# Altium schematic sheet sch_stm32.SCHDOC: Dynamic Torque Monitor
size A2; Revision: v2-mini; SheetNumber: SCHV2-mini
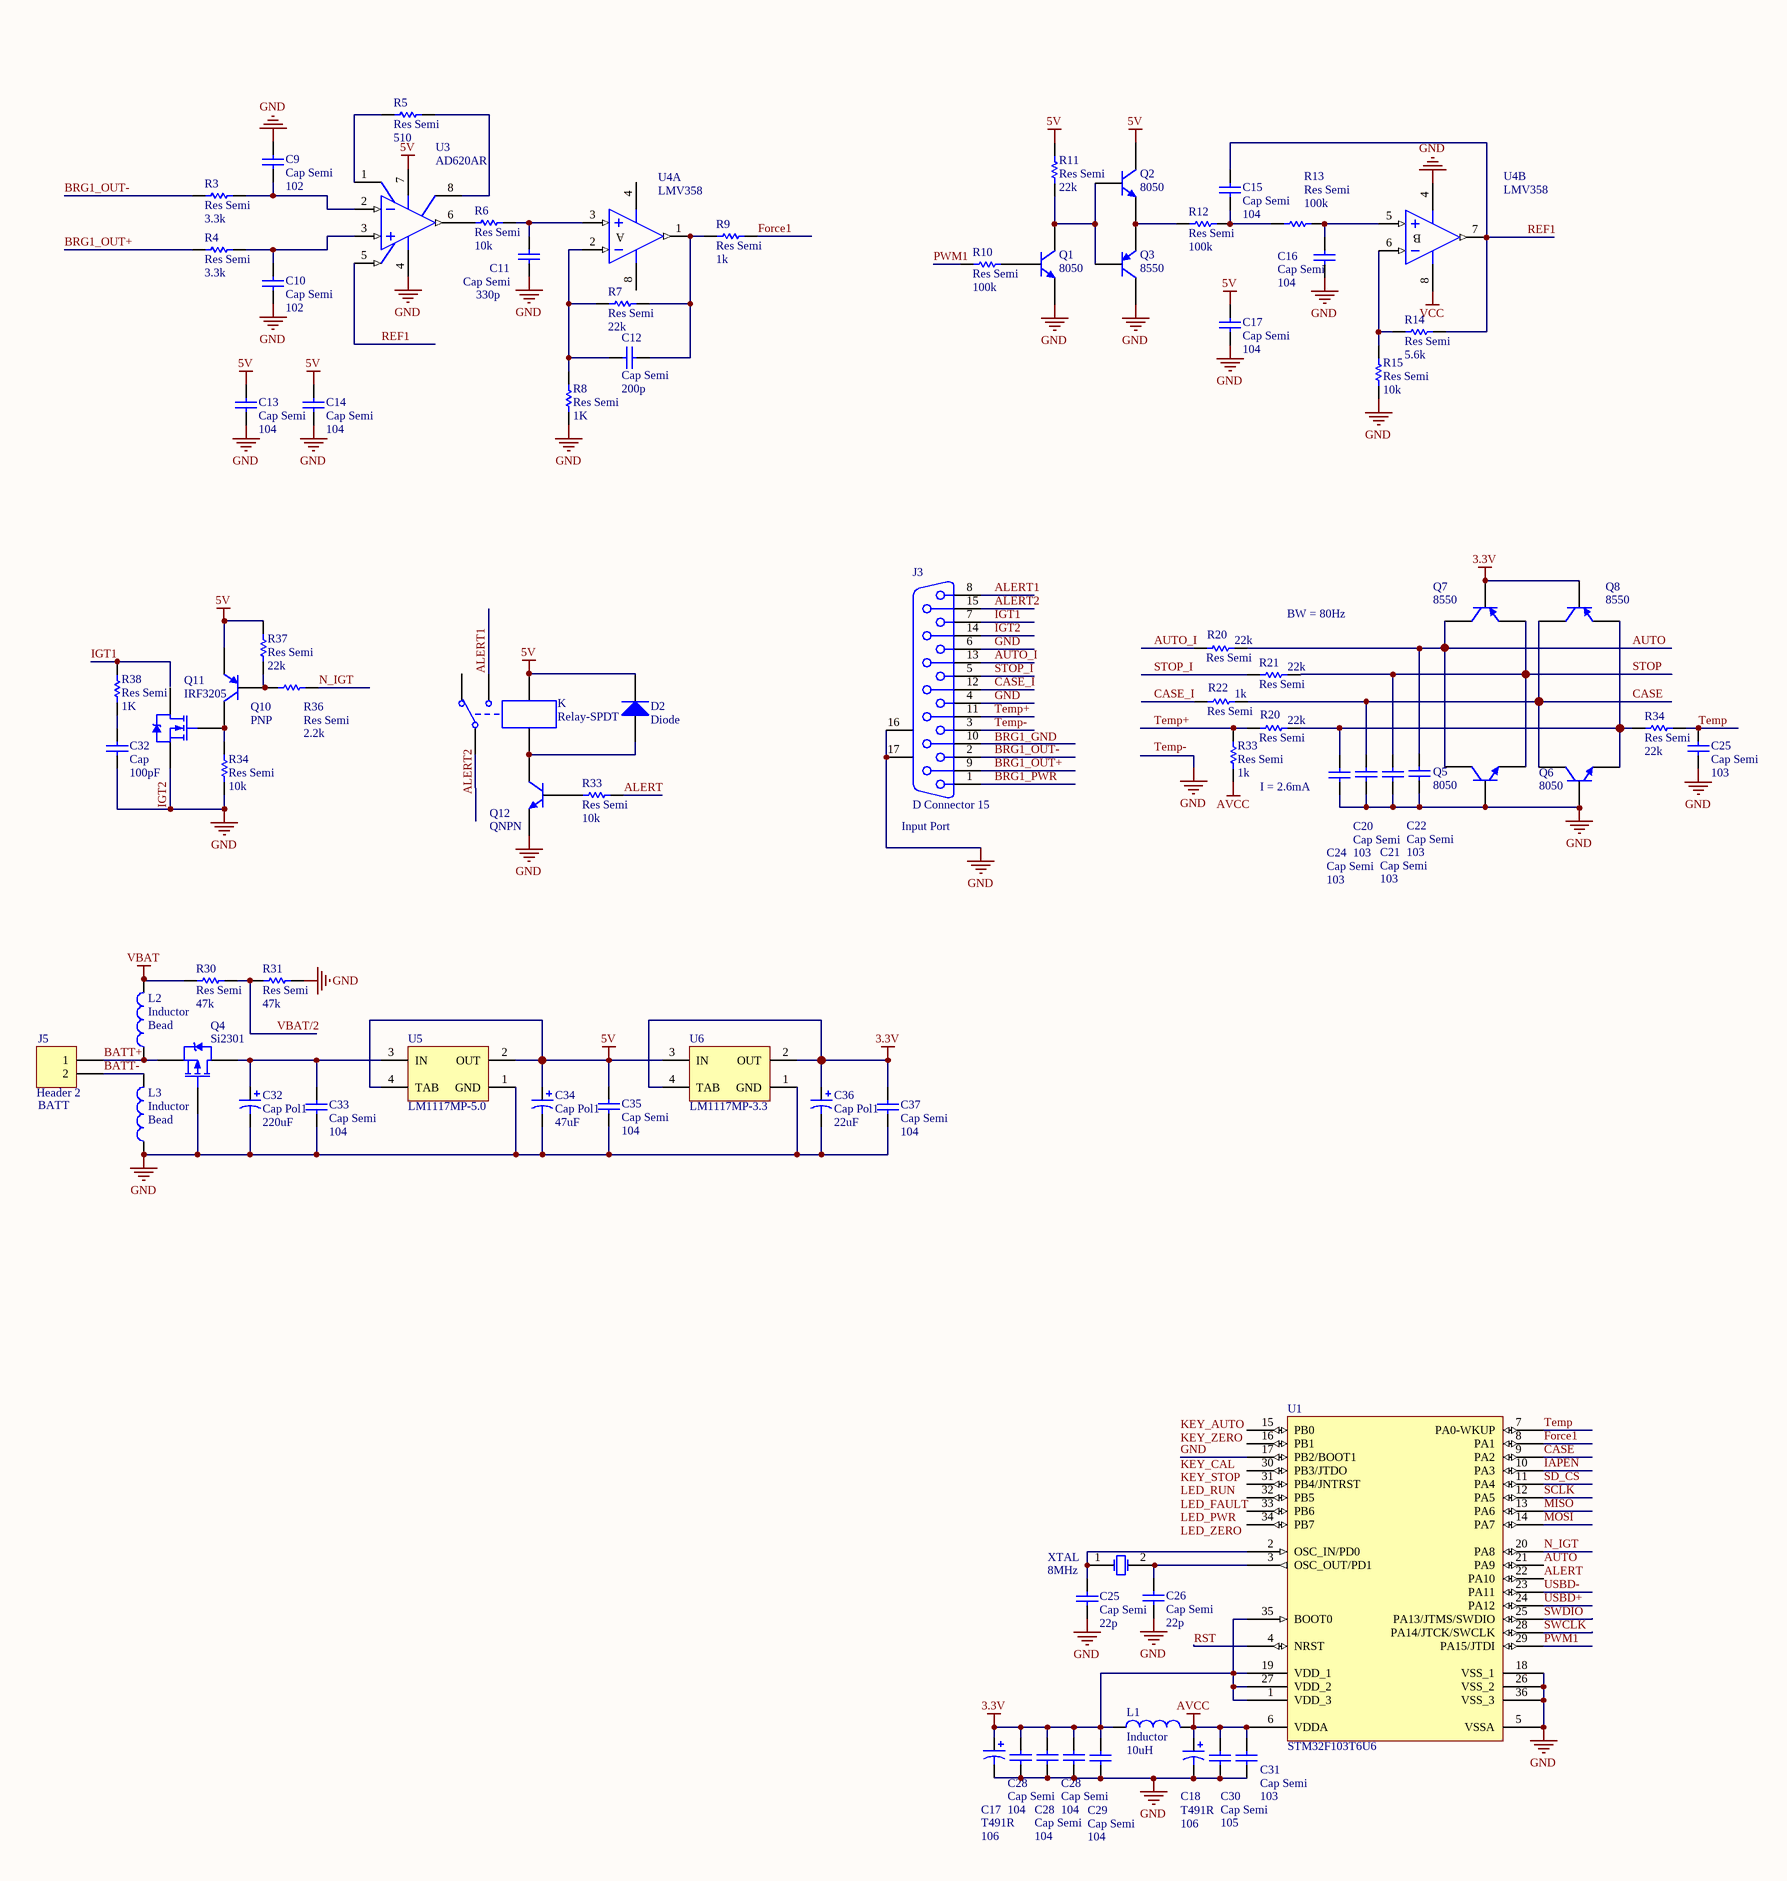
[diagram p0: sch_stm32.SCHDOC, left]
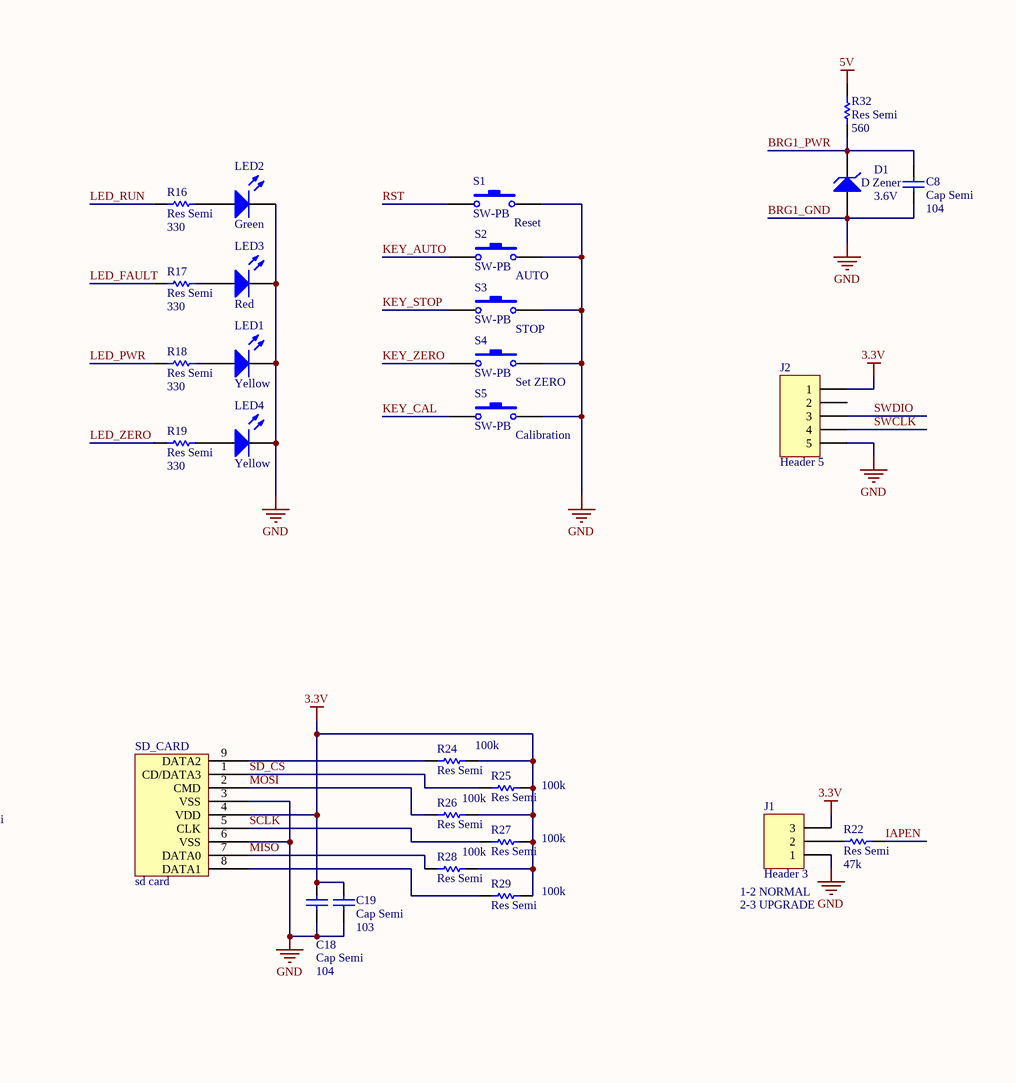
[diagram p1: sch_stm32.SCHDOC, right]

## Parts
(Parts that share a designator on the sheet are numbered #1, #2 ... from top to bottom, then left to right.)
C8  Cap Semi  value 104  [CAPC2012N]
C9  Cap Semi  value 102  [CAPC2012N]
C10  Cap Semi  value 102  [CAPC2012N]
C11  Cap Semi  value 330p  [C0805]
C12  Cap Semi  value 200p  [CAPC2012N]
C13  Cap Semi  value 104  [CAPC2012N]
C14  Cap Semi  value 104  [CAPC2012N]
C15  Cap Semi  value 104  [CAPC2012N]
C16  Cap Semi  value 104  [CAPC2012N]
C17#1  Cap Semi  value 104  [CAPC2012N]
C17#2  T491R  value 106  [R]
C18#1  Cap Semi  value 104  [CAPC2012N]
C18#2  T491R  value 106  [R]
C19  Cap Semi  value 103  [CAPC2012N]
C20  Cap Semi  value 103  [CAPC2012N]
C21  Cap Semi  value 103  [CAPC2012N]
C22  Cap Semi  value 103  [CAPC2012N]
C24  Cap Semi  value 103  [C0805]
C25#1  Cap Semi  value 103  [C0805]
C25#2  Cap Semi  value 22p  [CAPC2012N]
C26  Cap Semi  value 22p  [CAPC2012N]
C28#1  Cap Semi  value 104  [CAPC2012N]
C28#2  Cap Semi  value 104  [CAPC2012N]
C28#3  Cap Semi  value 104  [CAPC2012N]
C29  Cap Semi  value 104  [CAPC2012N]
C30  Cap Semi  value 105  [CAPC2012N]
C31  Cap Semi  value 103  [CAPC2012N]
C32#1  Cap  value 100pF  [RAD-0.3]
C32#2  Cap Pol1  value 220uF  [RB7.6-15]
C33  Cap Semi  value 104  [CAPC2012N]
C34  Cap Pol1  value 47uF  [RB7.6-15]
C35  Cap Semi  value 104  [C0805]
C36  Cap Pol1  value 22uF  [RB7.6-15]
C37  Cap Semi  value 104  [C0805]
D1  D Zener  Voltage: 3.6V  [DIODE-0.7]
D2  Diode  [SMC]
J1  Header 3  [HDR1X3]
J2  Header 5  [HDR1X5]
J3  D Connector 15  [DSUB1.385-2H15]
J5  Header 2  [HDR1X2]
K  Relay-SPDT  [MODULE5B]
L1  Inductor  value 10uH  [INDC2012N]
L2  Inductor  value Bead  [AXIAL-0.3]
L3  Inductor  value Bead  [AXIAL-0.3]
LED1  Yellow  [2.0X1.25X0.8A]
LED2  Green  [2.0X1.25X0.8A]
LED3  Red  [2.0X1.25X0.8A]
LED4  Yellow  [2.0X1.25X0.8A]
Q1  8050  [SOT-23B_N]
Q2  8050  [SOT-23B_N]
Q3  8550  [SOT-23B_N]
Q4  Si2301  [SOT-23B_L]
Q5  8050  [TO-92A]
Q6  8050  [TO-92A]
Q7  8550  [TO-92A]
Q8  8550  [TO-92A]
Q10  PNP  [SOT-23B_N]
Q11  IRF3205  [TO-220AB]
Q12  QNPN  [SOT-23B_N]
R3  Res Semi  value 3.3k  [6-0805_N]
R4  Res Semi  value 3.3k  [6-0805_N]
R5  Res Semi  value 510  [6-0805_N]
R6  Res Semi  value 10k  [6-0805_N]
R7  Res Semi  value 22k  [6-0805_N]
R8  Res Semi  value 1K  [6-0805_N]
R9  Res Semi  value 1k  [6-0805_N]
R10  Res Semi  value 100k  [6-0805_N]
R11  Res Semi  value 22k  [6-0805_N]
R12  Res Semi  value 100k  [6-0805_N]
R13  Res Semi  value 100k  [6-0805_N]
R14  Res Semi  value 5.6k  [6-0805_N]
R15  Res Semi  value 10k  [6-0805_N]
R16  Res Semi  value 330  [6-0805_N]
R17  Res Semi  value 330  [6-0805_N]
R18  Res Semi  value 330  [6-0805_N]
R19  Res Semi  value 330  [6-0805_N]
R20#1  Res Semi  value 22k  [6-0805_N]
R20#2  Res Semi  value 22k  [6-0805_N]
R21  Res Semi  value 22k  [6-0805_N]
R22#1  Res Semi  value 1k  [6-0805_N]
R22#2  Res Semi  value 47k  [6-0805_N]
R24  Res Semi  value 100k  [6-0805_N]
R25  Res Semi  value 100k  [6-0805_N]
R26  Res Semi  value 100k  [6-0805_N]
R27  Res Semi  value 100k  [6-0805_N]
R28  Res Semi  value 100k  [6-0805_N]
R29  Res Semi  value 100k  [6-0805_N]
R30  Res Semi  value 47k  [6-0805_N]
R31  Res Semi  value 47k  [6-0805_N]
R32  Res Semi  value 560  [6-0805_N]
R33#1  Res Semi  value 1k  [0805[2012]]
R33#2  Res Semi  value 10k  [0805[2012]]
R34#1  Res Semi  value 22k  [0805[2012]]
R34#2  Res Semi  value 10k  [0805[2012]]
R36  Res Semi  value 2.2k  [0805[2012]]
R37  Res Semi  value 22k  [0805[2012]]
R38  Res Semi  value 1K  [AXIAL-0.5]
S1  SW-PB  [KEY_4]
S2  SW-PB  [KEY_4]
S3  SW-PB  [KEY_4]
S4  SW-PB  [KEY_4]
S5  SW-PB  [KEY_4]
SD_CARD  sd card  [SD card]
U1  STM32F103T6U6  [VFQN36_M]
U3  AD620AR  [R-8D_N]
U4  LMV358  [SO8_N]  (parts A,B of 2)
U5  LM1117MP-5.0  [MP04A_N]
U6  LM1117MP-3.3  [MP04A_N]
XTAL  8MHz  [CRYSTAL]

## Nets
3.3V: C17#2.1 C18#1.2 C19.2 C28#1.2 C28#2.2 C28#3.2 C29.2 C36.1 C37.2 J1.3 J2.1 L1.1 Q7.2(B) Q8.2(B) R24.2 R25.2 R26.2 R27.2 R28.2 R29.2 SD_CARD.4(VDD) U1.1(VDD_3) U1.19(VDD_1) U1.27(VDD_2) U1.35(BOOT0) U6.2(OUT) U6.4(TAB)
5V: C13.1 C14.1 C17#1.1 C34.1 C35.2 D2.2(K) K.5 Q2.1(C) Q10.3(E) R11.2 R32.2 R37.2 U3.7(V+) U5.2(OUT) U5.4(TAB) U6.3(IN)
AVCC: C18#2.1 C30.2 C31.2 L1.2 R33#1.1 U1.6(VDDA)
BRG1_GND: C8.2 C9.2 C10.1 C11.1 C13.2 C14.2 C16.2 C17#1.2 C17#2.2 C18#1.1 C18#2.2 C19.1 C20.1 C21.1 C22.1 C24.1 C25#1.1 C25#2.1 C26.1 C28#1.1 C28#2.1 C28#3.1 C29.1 C30.1 C31.1 C32#1.1 C32#2.2 C33.1 C34.2 C35.1 C36.2 C37.1 D1.1(A) J1.1 J2.5 J3.4 J3.6 J3.14 J3.16(MH1) J3.17(MH2) L3.1 LED1.2(K) LED2.2(K) LED3.2(K) LED4.2(K) Q1.3(E) Q3.1(C) Q4.1(G) Q5.2(B) Q6.2(B) Q11.3(S) Q12.3(E) R8.1 R15.1 R31.1 R34#2.1 S1.2 S2.2 S3.2 S4.2 S5.2 SD_CARD.3(VSS) SD_CARD.6(VSS) U1.5(VSSA) U1.17(PB2/BOOT1) U1.18(VSS_1) U1.26(VSS_2) U1.36(VSS_3) U3.4(V-) U4.4(V-) U5.1(GND) U6.1(GND)  [also labelled GND, IGT2]
VBAT: L2.2 R30.2
VCC: U4.8(V+)
ALERT: R33#2.2 U1.22(PA10)
ALERT1: J3.8 K.3
ALERT2: J3.15 K.1
AUTO: C22.2 R20#1.2 U1.21(PA9)
AUTO_I: J3.13 R20#1.1
BATT+: J5.1 L2.1 Q4.3(S)
BATT-: J5.2 L3.2
BRG1_OUT+: J3.9 R4.1
BRG1_OUT-: J3.2 R3.1
BRG1_PWR: C8.1 D1.2(K) J3.1 R32.1
CASE: C20.2 Q6.3(C) Q8.3(C) R22#1.2 U1.9(PA2)
CASE_I: J3.12 R22#1.1
Force1: R9.2 U1.8(PA1)
IAPEN: R22#2.1 U1.10(PA3)
IGT1: J3.7 R38.2
KEY_AUTO: S2.1
KEY_CAL: S5.1
KEY_STOP: S3.1
KEY_ZERO: S4.1
LED_FAULT: R17.1
LED_PWR: R18.1
LED_RUN: R16.1
LED_ZERO: R19.1
MISO: R28.1 SD_CARD.7(DATA0) U1.13(PA6)
MOSI: R26.1 SD_CARD.2(CMD) U1.14(PA7)
N_IGT: R36.2 U1.20(PA8)
PWM1: R10.2 U1.29(PA15/JTDI)
REF1: C15.1 R14.2 U3.5(REF) U4.7(OUT)
RST: S1.1 U1.4(NRST)
SCLK: R27.1 SD_CARD.5(CLK) U1.12(PA5)
SD_CS: R25.1 SD_CARD.1(CD/DATA3) U1.11(PA4)
STOP: C21.2 Q5.1(E) Q7.1(E) R21.2
STOP_I: J3.5 R21.1
SWCLK: J2.4 U1.28(PA14/JTCK/SWCLK)
SWDIO: J2.3 U1.25(PA13/JTMS/SWDIO)
Temp: C25#1.2 R34#1.2 U1.7(PA0-WKUP)
Temp+: J3.11 R20#2.1 R33#1.2
Temp-: J3.3
USBD+: U1.24(PA12)
USBD-: U1.23(PA11)
VBAT/2: R30.1 R31.2
NetC9_1: C9.1 R3.2 U3.2(-IN)
NetC10_2: C10.2 R4.2 U3.3(+IN)
NetC11_2: C11.2 R6.1 U4.3(IN+)
NetC12_1: C12.1 R7.2 R9.1 U4.1(OUT)
NetC12_2: C12.2 R7.1 R8.2 U4.2(IN-)
NetC15_2: C15.2 R12.2 R13.1
NetC16_1: C16.1 R13.2 U4.5(IN+)
NetC24_2: C24.2 Q6.1(E) Q8.1(E) R20#2.2 R34#1.1
NetC25#2_2: C25#2.2 U1.2(OSC_IN/PD0) XTAL.1(OSC1)
NetC26_2: C26.2 U1.3(OSC_OUT/PD1) XTAL.2(OSC2)
NetC32#1_2: C32#1.2 R38.1
NetC32#2_1: C32#2.1 C33.2 Q4.2(D) U5.3(IN)
NetD2_1: D2.1(A) K.4 Q12.1(C)
NetJ1_2: J1.2 R22#2.2
NetLED1_1: LED1.1(A) R18.2
NetLED2_1: LED2.1(A) R16.2
NetLED3_1: LED3.1(A) R17.2
NetLED4_1: LED4.1(A) R19.2
NetQ1_1: Q1.1(C) Q2.2(B) Q3.2(B) R11.1
NetQ1_2: Q1.2(B) R10.1
NetQ2_3: Q2.3(E) Q3.3(E) R12.1
NetQ5_3: Q5.3(C) Q7.3(C)
NetQ10_1: Q10.1(C) Q11.1(G) R34#2.2
NetQ10_2: Q10.2(B) R36.1 R37.1
NetQ12_2: Q12.2(B) R33#2.1
NetR5_1: R5.1 U3.1(RG)
NetR5_2: R5.2 U3.8(RG)
NetR6_2: R6.2 U3.6(OUT)
NetR14_1: R14.1 R15.2 U4.6(IN-)
NetR24_1: R24.1 SD_CARD.9(DATA2)
NetR29_1: R29.1 SD_CARD.8(DATA1)

Not connected (* = marked no-connect by the designer): J2 2; J3 10; K 2; Q11 2(D); U1 15(PB0) 16(PB1) 30(PB3/JTDO) 31(PB4/JNTRST) 32(PB5) 33(PB6) 34(PB7)

## Notes on the sheet
- (near S1) Reset
- (near S2) AUTO
- (near S3) STOP
- (near S4) Set ZERO
- (near S5) Calibration
- BW = 80Hz
- (near J3) Input Port
- I = 2.6mA
- (near J1) 1-2 NORMAL
- 2-3 UPGRADE
- (near J5) BATT
- Labels drawn without touching a wire or pin: BRG1_GND, KEY_AUTO, KEY_CAL, KEY_STOP, KEY_ZERO, LED_FAULT, LED_PWR, LED_RUN, LED_ZERO, Temp-
- (in symbol TL062CD, part A) A
- (in symbol TL062CD, part B) B

## Library data of the parts
C8-C16 C17#1 C18#1 C19-C22 C24 C25#1 C25#2 C26 C28#1-C28#3 C29-C31 C33 C35 C37 = Cap Semi: Capacitor (Semiconductor SIM Model); Published: 8-Jun-2000; PackageReference: C1206; Publisher: Altium Limited
  C8-C10 C12-C16 C17#1 C18#1 C19-C22 C25#2 C26 C28#1-C28#3 C29-C31: LatestRevisionDate: 17-Jul-2002; LatestRevisionNote: Re-released for DXP Platform.
  C11 C24 C25#1 C33 C35 C37: LatestRevisionDate: 29-May-2009; LatestRevisionNote: IPC-7351 Footprint Added.; PackageDescription: Chip Capacitor
C17#2 C18#2 = T491R: Solid Tantalum Chip Capacitor, Low Profile T491 Series - Industrial Grade; Published: 17-Jul-2002; LatestRevisionDate: 19-Mar-2004; LatestRevisionNote: Silkscreen dimensions re-sized.; DatasheetDocument: Mar-2001; PackageDocument: Mar-2001; PackageReference: R; Publisher: Altium Limited; Code_JEITA: 2012-12; ComponentLink1Description: Manufacturer Link; ComponentLink1URL: http://www.kemet.com/; ComponentLink2Description: Datasheet; ComponentLink2URL: http://www.kemet.com/kemet/web/homepage/kechome.nsf/vapubfilesname/F3102TA.pdf/$file/F3102TA.pdf
C32#1 = Cap: Capacitor; Published: 8-Jun-2000; LatestRevisionDate: 17-Jul-2002; LatestRevisionNote: Re-released for DXP Platform.; PackageReference: RAD-0.3; Publisher: Altium Limited; PackageDescription: Radial Cap, Thru-Hole; 2 Leads; 0.3 in Pin Spacing
C32#2 C34 C36 = Cap Pol1: Polarized Capacitor (Radial); Published: 8-Jun-2000; LatestRevisionDate: 17-Jul-2002; LatestRevisionNote: Re-released for DXP Platform.; PackageReference: RB7.6-15; Publisher: Altium Limited; PackageDescription: Polarized Capacitor (Radial); 2 Leads
D1 = D Zener: Zener Diode; Published: 8-Jun-2000; LatestRevisionDate: 17-Jul-2002; LatestRevisionNote: Re-released for DXP Platform.; PackageReference: DIODE-0.7; Publisher: Altium Limited; PackageDescription: Diode, Thru-Hole; 2 Leads; 0.7 in Pin Spacing
D2 = Diode: Default Diode; Published: 8-Jun-2000; LatestRevisionDate: 17-Jul-2002; LatestRevisionNote: Re-released for DXP Platform.; PackageVersion: Sep-1996; PackageReference: SMC; Publisher: Altium Limited; PackageDescription: DO-214-AB/SMC; 2 C-Bend Leads; Body 7.9 x 5.9 mm, inc. leads (LxW); Code_JEDEC: DO-214-AB
J1 = Header 3: Header, 3-Pin; LatestRevisionDate: 17-Jul-2002; LatestRevisionNote: Re-released for DXP Platform.; Publisher: Altium Limited
J2 = Header 5: Header, 5-Pin; LatestRevisionDate: 17-Jul-2002; LatestRevisionNote: Re-released for DXP Platform.; Publisher: Altium Limited
J3 = D Connector 15: Receptacle Assembly, 15 Position, Right Angle; PackageDocument: O; Positions: 15; Published: 15-Jun-2001; LatestRevisionDate: 17-Jul-2002; LatestRevisionNote: Re-released for DXP Platform.; DatasheetDocument: 1-Sep-99; PackageReference: 788757; Publisher: Altium Limited; Orientation: Right Angle; Gender: Receptacle
J5 = Header 2: Header, 2-Pin; LatestRevisionDate: 17-Jul-2002; LatestRevisionNote: Re-released for DXP Platform.; Publisher: Altium Limited
K = Relay-SPDT: Single-Pole Dual-Throw Relay; Published: 24-Mar-1999; LatestRevisionDate: 17-Jul-2002; LatestRevisionNote: Re-released for DXP Platform.; PackageReference: MODULE5B; Publisher: Altium Limited
L1-L3 = Inductor: Code_IEC: 1005; Published: 8-Jun-2000; LatestRevisionDate: 17-Jul-2002; LatestRevisionNote: Re-released for DXP Platform.; PackageReference: 0402-A; Publisher: Altium Limited; Code_JEITA: 0402
LED1-LED4 = LED1: Typical RED GaAs LED; Published: 8-Jun-2000; LatestRevisionDate: 08-Jul-2005; LatestRevisionNote: Mech Layer 1 removed.; PackageReference: LED-1; Publisher: Altium Limited
Q1 Q2 Q12 = QNPN: NPN Bipolar Transistor; Published: 8-Jun-2000; LatestRevisionDate: 29-May-2009; LatestRevisionNote: IPC-7351 Footprint Added.; PackageVersion: Aug-1999; PackageReference: SOT-23B; Publisher: Altium Limited; PackageDescription: 3-Pin SOT-23 Package 0.95 mm Pitch, 2.4 mm Lead Span
Q3 Q10 = PNP: PNP Bipolar Transistor; Published: 8-Jun-2000; LatestRevisionDate: 29-May-2009; LatestRevisionNote: IPC-7351 Footprint Added.; PackageVersion: Aug-1999; PackageReference: SOT-23B; Publisher: Altium Limited; PackageDescription: 3-Pin SOT-23 Package 0.95 mm Pitch, 2.4 mm Lead Span
Q4 = PMOS-2: P-Channel Power MOSFET; pin to pad: 2>3 3>2; Note: Pin 4 not drawn and electrically connected to Pin 2.; Published: 8-Jun-2000; LatestRevisionDate: 17-Jul-2002; LatestRevisionNote: Re-released for DXP Platform.; DatasheetVersion: PD-9.390D; PackageVersion: Feb-1997; PackageReference: TO-220AB; Publisher: Altium Limited; PackageDescription: TO, Thru-Hole, Vertical, Heatsink Mounted; 3 In-Line Leads; Pitch 2.54 mm; ComponentLink1Description: Manufacturer Link; ComponentLink1URL: http://www.irf.com/
Q5 Q6 = 2N3904: NPN General Purpose Amplifier; Published: 8-Jun-2000; LatestRevisionDate: 15-Jan-2003; LatestRevisionNote: PCB Footprint 'BCY-W3/D4.7' replaced; DatasheetVersion: 1997; PackageVersion: Sep-1998; PackageReference: TO-92A; Publisher: Altium Limited; PackageDescription: TO, Flat Index; 3 In-Line, Axial Leads; Body Dia. 4.5mm; Leads 0.51 x 0.48 mm (max); ComponentLink1Description: Manufacturer Link; ComponentLink1URL: http://www.fairchildsemi.com/; ComponentLink2Description: Datasheet; ComponentLink2URL: http://www.fairchildsemi.com/ds/2N%2F2N3904.pdf
Q7 Q8 = 2N3906: PNP General Purpose Amplifier; Published: 8-Jun-2000; LatestRevisionDate: 15-Jan-2003; LatestRevisionNote: PCB Footprint 'BCY-W3/D4.7' replaced; DatasheetVersion: 1997; PackageVersion: Sep-1998; PackageReference: TO-92A; Publisher: Altium Limited; PackageDescription: TO, Flat Index; 3 In-Line, Axial Leads; Body Dia. 4.5mm; Leads 0.51 x 0.48 mm (max); ComponentLink1Description: Manufacturer Link; ComponentLink1URL: http://www.fairchildsemi.com/; ComponentLink2Description: Datasheet; ComponentLink2URL: http://www.fairchildsemi.com/ds/2N%2F2N3906.pdf
Q11 = IRF3205: HEXFET Power MOSFET; Note: Pin 2 is electrically connected to pin 4.; Published: 8-Jun-2000; LatestRevisionDate: 17-Jul-2002; LatestRevisionNote: Re-released for DXP Platform.; DatasheetVersion: Aug-1997; PackageVersion: Feb-1997; PackageReference: TO-220AB; Publisher: Altium Limited; PackageDescription: TO, Thru-Hole, Vertical, Heatsink Mounted; 3 In-Line Leads; Pitch 2.54 mm; ComponentLink1Description: Manufacturer Link; ComponentLink1URL: http://www.irf.com/; ComponentLink2Description: Datasheet; ComponentLink2URL: http://www.irf.com/product-info/datasheets/data/irf3205.pdf
R3-R19 R20#1 R20#2 R21 R22#1 R22#2 R24-R32 R33#1 R33#2 R34#1 R34#2 R36-R38 = Res Semi: Semiconductor Resistor; Published: 8-Jun-2000; LatestRevisionDate: 17-Jul-2002; LatestRevisionNote: Re-released for DXP Platform.; PackageReference: AXIAL-0.5; Publisher: Altium Limited
  R32 R33#1 R33#2 R34#1 R34#2 R36-R38: PackageDescription: Axial Device, Thru-Hole; 2 Leads; 0.5 in Pin Spacing
S1-S5 = SW-PB: Switch; Published: 24-Mar-1999; LatestRevisionDate: 17-Jul-2002; LatestRevisionNote: Re-released for DXP Platform.; PackageReference: SPST-2; Publisher: Altium Limited
U1 = STM32F103T6U6: STM32 ARM-based 32-bit MCU with 32 Kbytes Flash, 36-pin VFQFPN, Industrial Temperature; Published: 30-May-2008; DatasheetVersion: rev6, Mar-2008; PackageVersion: Mar-2008; PackageReference: VFQN36; Publisher: Altium Limited; PackageDescription: 36-Pin Quad Flat No-Lead, 6 x 6 X 1.0 mm Body, 0.5 mm Pitch, Exposed Pad (VFQN36); ComponentLink1Description: Manufacturer Link; ComponentLink1URL: www.st.com/stm32; ComponentLink2Description: Datasheet; ComponentLink2URL: http://www.st.com/stonline/products/literature/ds/13587.pdf
U3 = AD620AR: Low-Cost, Low-Power Instrumentation Amplifier; Published: 8-Jun-2000; LatestRevisionDate: 13-Apr-2006; LatestRevisionNote: IPC-7351 Footprint Added.; DatasheetVersion: REV.D 1998; PackageVersion: 1998; PackageReference: R-8D; Publisher: Altium Limited; PackageDescription: 8-Pin Narrow Body Small Outline Integrated Circuit 1.27 mm Pitch; ComponentLink1Description: Manufacturer Link; ComponentLink1URL: http://www.analog.com/en/prod/0%2C2877%2CAD620%2C00.html; ComponentLink2Description: Datasheet; ComponentLink2URL: http://www.analog.com/UploadedFiles/Data_Sheets/897653854AD620_g.pdf
U4 = TL062CD: Low-Power J-FET Dual Bipolar Operational Amplifier; Published: 24-Aug-2001; LatestRevisionDate: 13-Apr-2006; LatestRevisionNote: IPC-7351 Footprint Added.; DatasheetVersion: Oct-1997; PackageVersion: Dec-2002; PackageReference: SO8; Publisher: Altium Limited; PackageDescription: 8-Pin Small Outline Integrated Circuit 1.27 mm Pitch; Code_JEDEC: MS-012-AA; Code_IPC: SOIC127P600-8; ComponentLink1Description: Manufacturer Link; ComponentLink1URL: http://www.st.com/; ComponentLink2Description: Datasheet; ComponentLink2URL: http://www.st.com/stonline/products/literature/ds/2294/tl062.pdf
U5 = LM1117MP-5.0: 800mA Low-Dropout Linear Regulator; Manufacturer: National Semiconductor; CompType: LDO IC; PackageTopMarking: XYTT*N06A; PowerWise: N; Published: 4-Dec-2008; DatasheetVersion: Apr-2006; PackageVersion: revB, Apr-2003; PackageReference: MP04A; Publisher: Altium Limited; PackageDescription: Molded SOT-223, 6.50 x 3.56 x 1.6mm Body, 4 Lead, 2.3mm Pitch; PartNumber: LM1117MP-5.0; RoHS: O; PinCount: 4; DigiKeyPartNumber: LM1117MP-5.0CT-ND; Code_JEDEC: TO-261-AA; Code_IPC: SOT223-4; ComponentLink1Description: LM1117 Datasheet; ComponentLink1URL: http://www.national.com/ds/LM/LM1117.pdf; ComponentLink2Description: LM1117 Web Page; ComponentLink2URL: http://www.national.com/pf/LM/LM1117.html; ComponentLink3Description: MP04A Package Page; ComponentLink3URL: http://www.national.com/packaging/folders/mp04a.html
U6 = LM1117MP-3.3: 800mA Low-Dropout Linear Regulator; Manufacturer: National Semiconductor; CompType: LDO IC; PackageTopMarking: XYTT*N05A; PowerWise: N; Published: 4-Dec-2008; DatasheetVersion: Apr-2006; PackageVersion: revB, Apr-2003; PackageReference: MP04A; Publisher: Altium Limited; PackageDescription: Molded SOT-223, 6.50 x 3.56 x 1.6mm Body, 4 Lead, 2.3mm Pitch; PartNumber: LM1117MP-3.3; RoHS: O; PinCount: 4; DigiKeyPartNumber: LM1117MP-3.3CT-ND; Code_JEDEC: TO-261-AA; Code_IPC: SOT223-4; ComponentLink1Description: LM1117 Datasheet; ComponentLink1URL: http://www.national.com/ds/LM/LM1117.pdf; ComponentLink2Description: LM1117 Web Page; ComponentLink2URL: http://www.national.com/pf/LM/LM1117.html; ComponentLink3Description: MP04A Package Page; ComponentLink3URL: http://www.national.com/packaging/folders/mp04a.html
XTAL = XTAL: Crystal Oscillator; Published: 8-Jun-2000; LatestRevisionDate: 17-Jul-2002; LatestRevisionNote: Re-released for DXP Platform.; PackageReference: R38; Publisher: Altium Limited